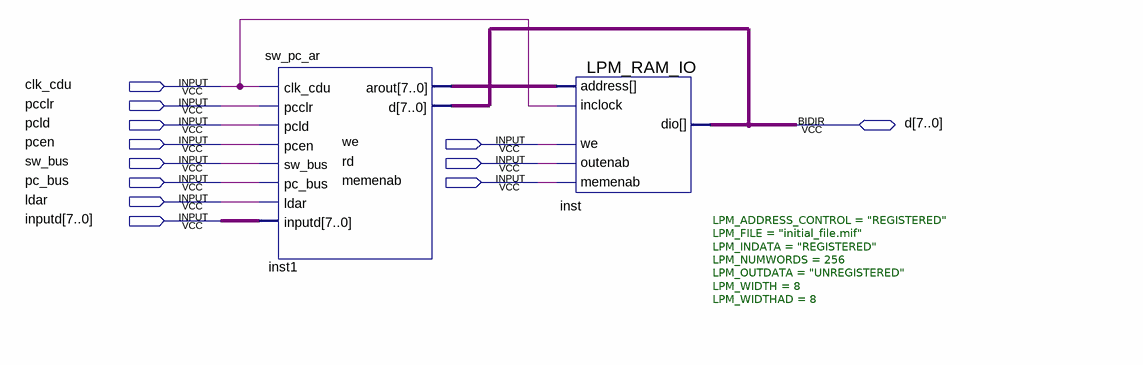
[diagram p0: schematic sheet]
// Quartus schematic exp_ram3.bdf as structural Verilog: 2 symbols, 12 pins
module exp_ram3 (
  input  clk_cdu,
  input  pcclr,
  input  pcld,
  input  pcen,
  input  we,
  input  sw_bus,
  input  rd,
  input  pc_bus,
  input  memenab,
  input  ldar,
  input  [7:0] inputd,
  inout  [7:0] d
);

  wire [7:0] inst1_arout;

  sw_pc_ar inst1 (
    .clk_cdu(clk_cdu), .pcclr(pcclr), .pcld(pcld), .pcen(pcen), .sw_bus(sw_bus), .pc_bus(pc_bus),
    .ldar(ldar), .inputd(inputd), .arout(inst1_arout), .d(d));
  LPM_RAM_IO #(.LPM_ADDRESS_CONTROL("REGISTERED"), .LPM_FILE("initial_file.mif"), .LPM_INDATA("REGISTERED"), .LPM_NUMWORDS(256), .LPM_OUTDATA("UNREGISTERED"), .LPM_WIDTH(8), .LPM_WIDTHAD(8)) inst (
    .address(inst1_arout), .memenab(memenab), .inclock(clk_cdu), .we(we), .outenab(rd), .dio(d));
endmodule
